# Altium schematic sheet InterfacesA_SWITCH_LEDS.SchDoc
size A
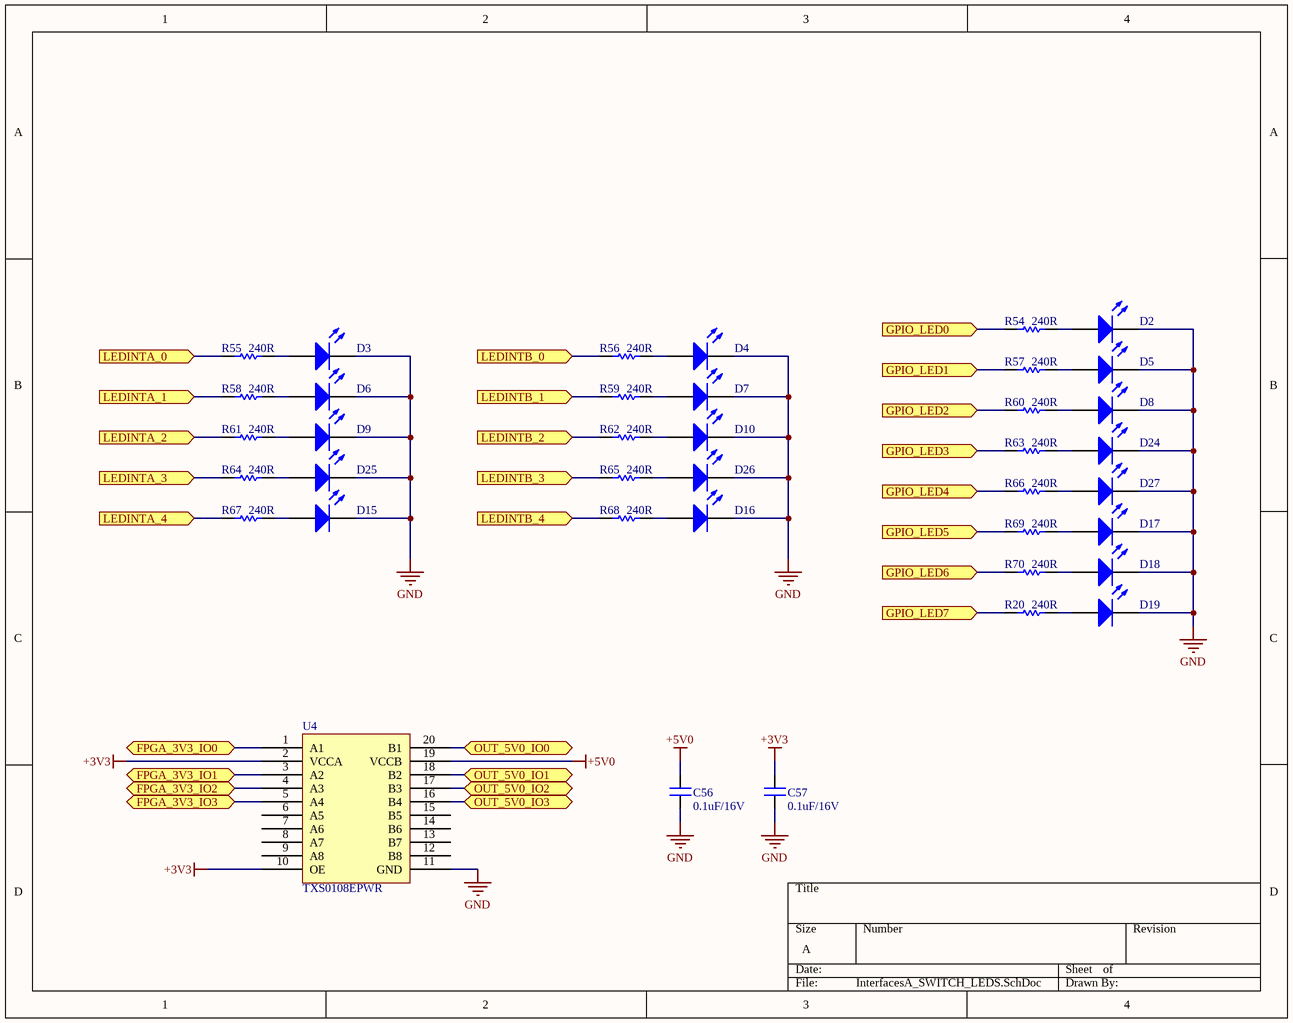
[diagram p0: InterfacesA_SWITCH_LEDS.SchDoc]

## Parts
C56  value 0.1uF/16V  [CAP_0805]  (hidden comment: CAP_0805)
C57  value 0.1uF/16V  [CAP_0805]  (hidden comment: CAP_0805)
D2  LED_0603  [LED_0603]  (value not drawn)
D3  LED_0603  [LED_0603]  (value not drawn)
D4  LED_0603  [LED_0603]  (value not drawn)
D5  LED_0603  [LED_0603]  (value not drawn)
D6  LED_0603  [LED_0603]  (value not drawn)
D7  LED_0603  [LED_0603]  (value not drawn)
D8  LED_0603  [LED_0603]  (value not drawn)
D9  LED_0603  [LED_0603]  (value not drawn)
D10  LED_0603  [LED_0603]  (value not drawn)
D15  LED_0603  [LED_0603]  (value not drawn)
D16  LED_0603  [LED_0603]  (value not drawn)
D17  LED_0603  [LED_0603]  (value not drawn)
D18  LED_0603  [LED_0603]  (value not drawn)
D19  LED_0603  [LED_0603]  (value not drawn)
D24  LED_0603  [LED_0603]  (value not drawn)
D25  LED_0603  [LED_0603]  (value not drawn)
D26  LED_0603  [LED_0603]  (value not drawn)
D27  LED_0603  [LED_0603]  (value not drawn)
R20  value 240R  [RES_0805]  (hidden comment: RES_0805)
R54  value 240R  [RES_0805]  (hidden comment: RES_0805)
R55  value 240R  [RES_0805]  (hidden comment: RES_0805)
R56  value 240R  [RES_0805]  (hidden comment: RES_0805)
R57  value 240R  [RES_0805]  (hidden comment: RES_0805)
R58  value 240R  [RES_0805]  (hidden comment: RES_0805)
R59  value 240R  [RES_0805]  (hidden comment: RES_0805)
R60  value 240R  [RES_0805]  (hidden comment: RES_0805)
R61  value 240R  [RES_0805]  (hidden comment: RES_0805)
R62  value 240R  [RES_0805]  (hidden comment: RES_0805)
R63  value 240R  [RES_0805]  (hidden comment: RES_0805)
R64  value 240R  [RES_0805]  (hidden comment: RES_0805)
R65  value 240R  [RES_0805]  (hidden comment: RES_0805)
R66  value 240R  [RES_0805]  (hidden comment: RES_0805)
R67  value 240R  [RES_0805]  (hidden comment: RES_0805)
R68  value 240R  [RES_0805]  (hidden comment: RES_0805)
R69  value 240R  [RES_0805]  (hidden comment: RES_0805)
R70  value 240R  [RES_0805]  (hidden comment: RES_0805)
U4  TXS0108EPWR  [TXS0108EPWR]

## Ports
FPGA_3V3_IO0 (bidir), FPGA_3V3_IO1 (bidir), FPGA_3V3_IO2 (bidir), FPGA_3V3_IO3 (bidir), GPIO_LED0 (in), GPIO_LED1 (in), GPIO_LED2 (in), GPIO_LED3 (in), GPIO_LED4 (in), GPIO_LED5 (in), GPIO_LED6 (in), GPIO_LED7 (in), LEDINTA_0 (in), LEDINTA_1 (in), LEDINTA_2 (in), LEDINTA_3 (in), LEDINTA_4 (in), LEDINTB_0 (in), LEDINTB_1 (in), LEDINTB_2 (in), LEDINTB_3 (in), LEDINTB_4 (in), OUT_5V0_IO0 (bidir), OUT_5V0_IO1 (bidir), OUT_5V0_IO2 (bidir), OUT_5V0_IO3 (bidir)

## Nets
+3V3: C57.2 U4.2(VCCA) U4.10(OE)
+5V0: C56.2 U4.19(VCCB)
GND: C56.1 C57.1 D2.2(K) D3.2(K) D4.2(K) D5.2(K) D6.2(K) D7.2(K) D8.2(K) D9.2(K) D10.2(K) D15.2(K) D16.2(K) D17.2(K) D18.2(K) D19.2(K) D24.2(K) D25.2(K) D26.2(K) D27.2(K) U4.11(GND)
FPGA_3V3_IO0: U4.1(A1) ; port FPGA_3V3_IO0
FPGA_3V3_IO1: U4.3(A2) ; port FPGA_3V3_IO1
FPGA_3V3_IO2: U4.4(A3) ; port FPGA_3V3_IO2
FPGA_3V3_IO3: U4.5(A4) ; port FPGA_3V3_IO3
GPIO_LED0: R54.2 ; port GPIO_LED0
GPIO_LED1: R57.2 ; port GPIO_LED1
GPIO_LED2: R60.2 ; port GPIO_LED2
GPIO_LED3: R63.2 ; port GPIO_LED3
GPIO_LED4: R66.2 ; port GPIO_LED4
GPIO_LED5: R69.2 ; port GPIO_LED5
GPIO_LED6: R70.2 ; port GPIO_LED6
GPIO_LED7: R20.2 ; port GPIO_LED7
LEDINTA_0: R55.2 ; port LEDINTA_0
LEDINTA_1: R58.2 ; port LEDINTA_1
LEDINTA_2: R61.2 ; port LEDINTA_2
LEDINTA_3: R64.2 ; port LEDINTA_3
LEDINTA_4: R67.2 ; port LEDINTA_4
LEDINTB_0: R56.2 ; port LEDINTB_0
LEDINTB_1: R59.2 ; port LEDINTB_1
LEDINTB_2: R62.2 ; port LEDINTB_2
LEDINTB_3: R65.2 ; port LEDINTB_3
LEDINTB_4: R68.2 ; port LEDINTB_4
OUT_5V0_IO0: U4.20(B1) ; port OUT_5V0_IO0
OUT_5V0_IO1: U4.18(B2) ; port OUT_5V0_IO1
OUT_5V0_IO2: U4.17(B3) ; port OUT_5V0_IO2
OUT_5V0_IO3: U4.16(B4) ; port OUT_5V0_IO3
NetD2_1: D2.1(A) R54.1
NetD3_1: D3.1(A) R55.1
NetD4_1: D4.1(A) R56.1
NetD5_1: D5.1(A) R57.1
NetD6_1: D6.1(A) R58.1
NetD7_1: D7.1(A) R59.1
NetD8_1: D8.1(A) R60.1
NetD9_1: D9.1(A) R61.1
NetD10_1: D10.1(A) R62.1
NetD15_1: D15.1(A) R67.1
NetD16_1: D16.1(A) R68.1
NetD17_1: D17.1(A) R69.1
NetD18_1: D18.1(A) R70.1
NetD19_1: D19.1(A) R20.1
NetD24_1: D24.1(A) R63.1
NetD25_1: D25.1(A) R64.1
NetD26_1: D26.1(A) R65.1
NetD27_1: D27.1(A) R66.1

Not connected (* = marked no-connect by the designer): U4 6(A5) 7(A6) 8(A7) 9(A8) 12(B8) 13(B7) 14(B6) 15(B5)

## Library data of the parts
U4 = TXS0108EPWR: Supplier 1: Digi-Key; Supplier Part Number 1: 296-21527-1-ND